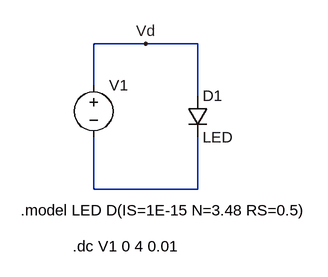
[diagram p0: schematic led.asc]
led.asc, the LTspice schematic file:
Version 4.1
SHEET 1 3448 2144
WIRE -432 256 -512 256
WIRE -352 256 -432 256
WIRE -512 320 -512 256
WIRE -352 336 -352 256
WIRE -512 480 -512 400
WIRE -352 480 -352 400
WIRE -352 480 -512 480
FLAG -432 256 Vd
SYMBOL voltage -512 304 R0
WINDOW 123 0 0 Left 0
WINDOW 39 0 0 Left 0
WINDOW 3 -65 57 Left 2
SYMATTR Value ""
SYMATTR InstName V1
SYMBOL diode -368 336 R0
SYMATTR InstName D1
SYMATTR Value LED
TEXT -624 512 Left 2 !.model LED D(IS=1E-15 N=3.48 RS=0.5)
TEXT -544 568 Left 2 !.dc V1 0 4 0.01

The netlist it stands for:
* led.asc
V1 Vd N001
D1 Vd N001 LED
.model D D
.lib standard.dio
.model LED D(IS=1E-15 N=3.48 RS=0.5)
.dc V1 0 4 0.01
.backanno
.end